# Altium schematic sheet 创意时钟.SchDoc
size A4; PageSetup: Record=PageOptions|CenterHorizontal=True|CenterVertical=True|PrintScale=1.00|XCorrection=1.00|YCorrection=1.00|PrintKind=0|BorderSize=5000000|LeftOffset=0|BottomOffset=0|Orientation=2|PaperLength=2970|PaperWidth=2100|Scale=100|PaperSource=7|PrintQuality=600|MediaType=1|DitherType=10|PrintScaleMode=1|PaperKind=A4|PaperIndex=9
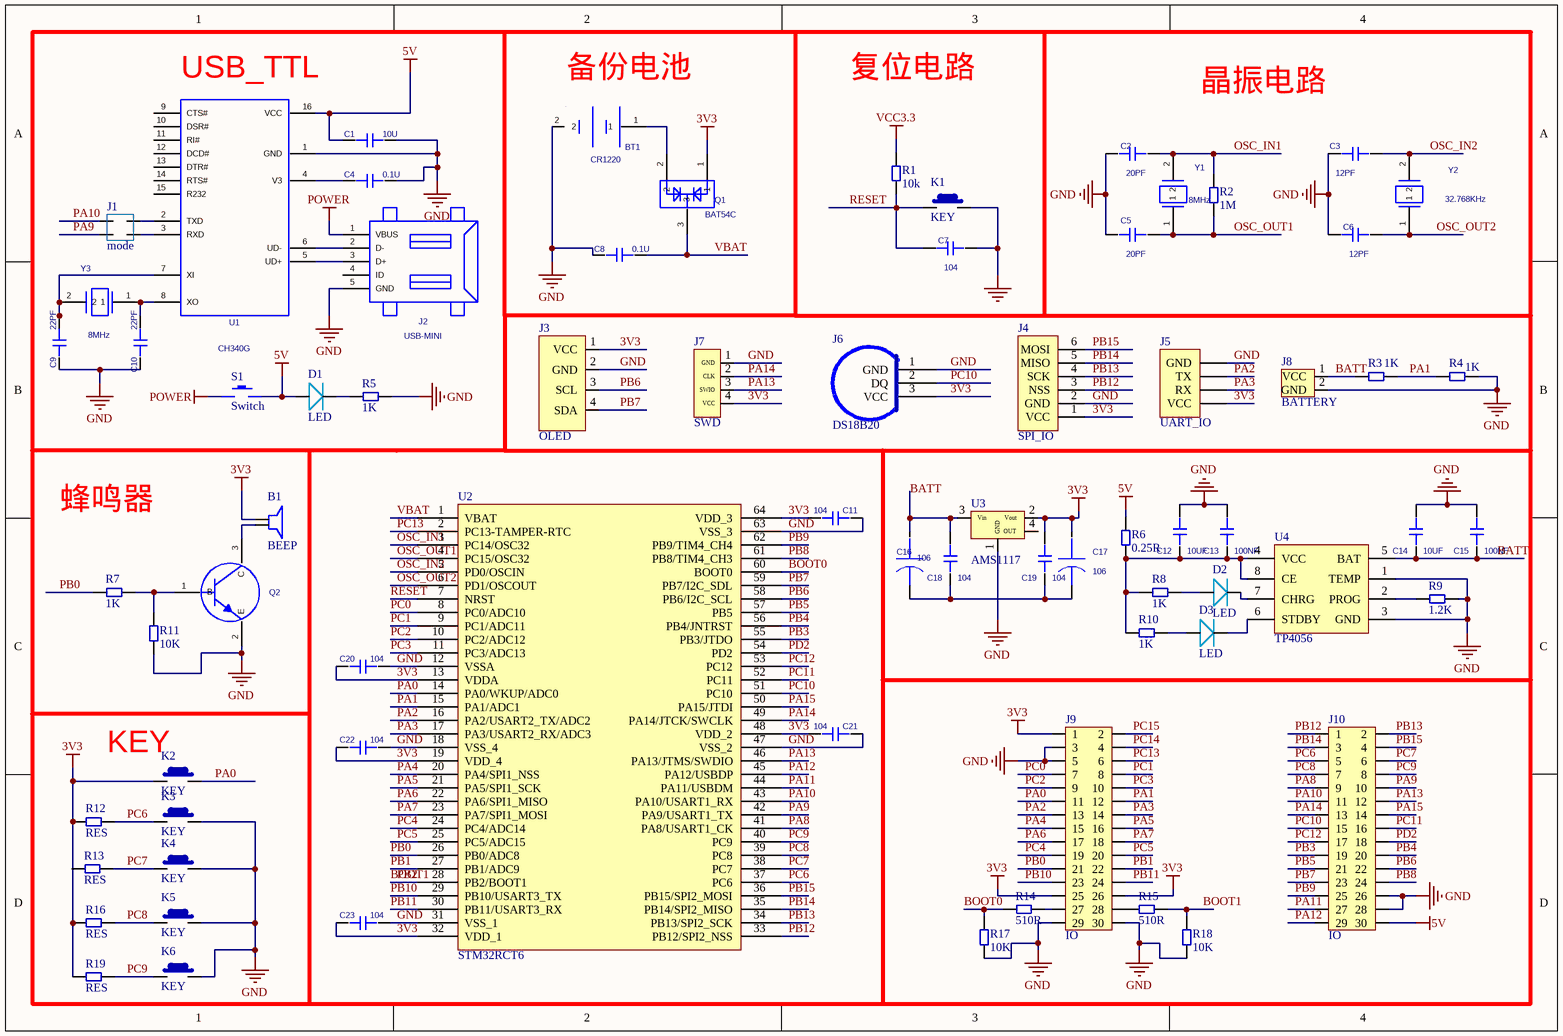
[diagram p0: 创意时钟.SchDoc]

## Parts
B1  BEEP  [BEEP-9.5X5.5]
BT1  CR1220  [BATERY]
C1  value 10U  [RES_0603_FIRE]  (hidden comment: CAP_10P_0603_FIRE)
C2  value 20PF  [CAP_0603_FIRE]  (hidden comment: CAP_20P_0603_FIRE)
C3  value 12PF  [CAP_0603_FIRE]  (hidden comment: CAP_20P_0603_FIRE)
C4  value 0.1U  [RES_0603_FIRE]  (hidden comment: CAP_10P_0603_FIRE)
C5  value 20PF  [CAP_0603_FIRE]  (hidden comment: CAP_20P_0603_FIRE)
C6  value 12PF  [CAP_0603_FIRE]  (hidden comment: CAP_20P_0603_FIRE)
C7  value 104  [CAP_0603_FIRE]  (hidden comment: CAP_20P_0603_FIRE)
C8  value 0.1U  [RES_0603_FIRE]  (hidden comment: CAP_10P_0603_FIRE)
C9  value 22PF  [CAP_0603_FIRE]  (hidden comment: CAP_20P_0603_FIRE)
C10  value 22PF  [CAP_0603_FIRE]  (hidden comment: CAP_20P_0603_FIRE)
C11  value 104  [CAP_0603_FIRE]  (hidden comment: CAP_20P_0603_FIRE)
C12  value 10UF  [RES_0603_FIRE]  (hidden comment: CAP_10P_0603_FIRE)
C13  value 100NF  [RES_0603_FIRE]  (hidden comment: CAP_10P_0603_FIRE)
C14  value 10UF  [RES_0603_FIRE]  (hidden comment: CAP_10P_0603_FIRE)
C15  value 100NF  [RES_0603_FIRE]  (hidden comment: CAP_10P_0603_FIRE)
C16  value 106  [CAP+_47UF_FIRE]  (hidden comment: CAP+_47UF_FIRE)
C17  value 106  [CAP+_47UF_FIRE]  (hidden comment: CAP+_47UF_FIRE)
C18  value 104  [RES_0603_FIRE]  (hidden comment: CAP_10P_0603_FIRE)
C19  value 104  [RES_0603_FIRE]  (hidden comment: CAP_10P_0603_FIRE)
C20  value 104  [CAP_0603_FIRE]  (hidden comment: CAP_20P_0603_FIRE)
C21  value 104  [CAP_0603_FIRE]  (hidden comment: CAP_20P_0603_FIRE)
C22  value 104  [CAP_0603_FIRE]  (hidden comment: CAP_20P_0603_FIRE)
C23  value 104  [CAP_0603_FIRE]  (hidden comment: CAP_20P_0603_FIRE)
D1  LED  [0603_R_JX]
D2  LED  [0603_R_JX]
D3  LED  [0603_R_JX]
J1  mode  [mode]
J2  USB-MINI  [USB_MINI_B_FE_JX]
J3  OLED  [OLED]
J4  SPI_IO  [SPI_IO]
J5  UART_IO  [USART_IO]
J6  DS18B20  [DS18B20]
J7  SWD  [SWD]
J8  BATTERY  [XH_2501R_2P_LOCKED_JX]
J9  IO  [IO]
J10  IO  [IO]
K1  KEY  [KEY]
K2  KEY  [KEY]
K3  KEY  [KEY]
K4  KEY  [KEY]
K5  KEY  [KEY]
K6  KEY  [KEY]
Q1  BAT54C  [SOT-23]
Q2  8050  [SOT-23]  (value not drawn)
R1  10k  [0805]
R2  1M  [0805]
R3  1K  [0805]
R4  1K  [0805]
R5  1K  [0805]
R6  0.25R  [0805]
R7  1K  [0805]
R8  1K  [0805]
R9  1.2K  [0805]
R10  1K  [0805]
R11  10K  [0805]
R12  RES  [0805]
R13  RES  [0805]
R14  510R  [0805]
R15  510R  [0805]
R16  RES  [0805]
R17  10K  [0805]
R18  10K  [0805]
R19  RES  [0805]
S1  Switch  [SWITCH]
U1  CH340G  [SOP16]
U2  STM32RCT6  [LQFP64]
U3  AMS1117  [AMS-1117-3.3]
U4  TP4056  [SOP8_150MIL_JX]
Y1  value 8MHz  [XTAL_socket]  (hidden comment: XTAL_8M_FIRE)
Y2  value 32.768KHz  [CRYS-3X8]  (hidden comment: XTAL_32.768KHZ_FIRE)
Y3  value 8MHz  [XTAL_socket]  (hidden comment: XTAL_8M_FIRE)

## Nets
3V3: B1.1 C11.1 C17.1 C19.2 C20.2 C21.1 C22.2 C23.2 J3.1(VCC) J4.1(VCC) J5.1(VCC) J6.3(VCC) J7.4(VCC) J9.1 J9.25 J9.26 K2.1 Q1.1 R12.1 R16.1 R19.1 U2.13(VDDA) U2.19(VDD_4) U2.32(VDD_1) U2.48(VDD_2) U2.64(VDD_3) U3.2(Vout)
5V: C1.1 D1.1 J10.30 R6.2 S1.2(VCC) U1.16(VCC)
GND: BT1.2 C1.2 C2.1 C3.1 C4.2 C5.1 C6.1 C7.2 C8.1 C9.1 C10.1 C11.2 C12.2 C13.2 C14.2 C15.2 C20.1 C21.2 C22.1 C23.1 J2.5(GND) J3.2(GND) J4.2(GND) J5.4(GND) J6.1(GND) J7.1(GND) J8.2(GND) J9.3 J9.5 J9.29 J9.30 J10.26 J10.28 K1.2 K3.2 K4.2 K5.2 K6.2 Q2.2(E) R4.2 R5.2 R9.2 R11.1 R17.1 R18.1 U1.1(GND) U2.12(VSSA) U2.18(VSS_4) U2.31(VSS_1) U2.47(VSS_2) U2.63(VSS_3) U3.1(GND) U4.1(TEMP) U4.3(GND)
POWER: J2.1(VBUS) S1.1(VCC)
VCC3.3: R1.2
BATT: C14.1 C15.1 C16.1 C18.2 J8.1(VCC) R3.1 U3.3(Vin) U4.5(BAT)
BOOT0: R14.1 R17.2 U2.60(BOOT0)
BOOT1: R15.2 R18.2 U2.28(PB2/BOOT1)  [also labelled PB2]
OSC_IN1: C2.2 R2.2 U2.3(PC14/OSC32) Y1.2
OSC_IN2: C3.2 U2.5(PD0/OSCIN) Y2.2
OSC_OUT1: C5.2 R2.1 U2.4(PC15/OSC32) Y1.1
OSC_OUT2: C6.2 U2.6(PD1/OSCOUT) Y2.1
PA0: J9.11 K2.2 U2.14(PA0/WKUP/ADC0)
PA1: J9.12 R3.2 R4.1 U2.15(PA1/ADC1)
PA2: J5.3(TX) J9.13 U2.16(PA2/USART2_TX/ADC2)
PA3: J5.2(RX) J9.14 U2.17(PA3/USART2_RX/ADC3)
PA4: J9.15 U2.20(PA4/SPI1_NSS)
PA5: J9.16 U2.21(PA5/SPI1_SCK)
PA6: J9.17 U2.22(PA6/SPI1_MISO)
PA7: J9.18 U2.23(PA7/SPI1_MOSI)
PA8: J10.9 U2.41(PA8/USART1_CK)
PA9: J1.2 J10.10 U2.42(PA9/USART1_TX)
PA10: J1.1 J10.11 U2.43(PA10/USART1_RX)
PA11: J10.27 U2.44(PA11/USBDM)
PA12: J10.29 U2.45(PA12/USBDP)
PA13: J7.3(SWIO) J10.12 U2.46(PA13/JTMS/SWDIO)
PA14: J7.2(CLK) J10.13 U2.49(PA14/JTCK/SWCLK)
PA15: J10.14 U2.50(PA15/JTDI)
PB0: J9.21 R7.1 U2.26(PB0/ADC8)
PB1: J9.22 U2.27(PB1/ADC9)
PB3: J10.19 U2.55(PB3/JTDO)
PB4: J10.20 U2.56(PB4/JNTRST)
PB5: J10.21 U2.57(PB5)
PB6: J3.3(SCL) J10.22 U2.58(PB6/I2C_SCL)
PB7: J3.4(SDA) J10.23 U2.59(PB7/I2C_SDL)
PB8: J10.24 U2.61(PB8/TIM4_CH3)
PB9: J10.25 U2.62(PB9/TIM4_CH4)
PB10: J9.23 U2.29(PB10/USART3_TX)
PB11: J9.24 U2.30(PB11/USART3_RX)
PB12: J4.3(NSS) J10.1 U2.33(PB12/SPI2_NSS)
PB13: J4.4(SCK) J10.2 U2.34(PB13/SPI2_SCK)
PB14: J4.5(MISO) J10.3 U2.35(PB14/SPI2_MISO)
PB15: J4.6(MOSI) J10.4 U2.36(PB15/SPI2_MOSI)
PC0: J9.7 U2.8(PC0/ADC10)
PC1: J9.8 U2.9(PC1/ADC11)
PC2: J9.9 U2.10(PC2/ADC12)
PC3: J9.10 U2.11(PC3/ADC13)
PC4: J9.19 U2.24(PC4/ADC14)
PC5: J9.20 U2.25(PC5/ADC15)
PC6: J10.5 K3.1 R12.2 U2.37(PC6)
PC7: J10.6 K4.1 R13.2 U2.38(PC7)
PC8: J10.7 K5.1 R16.2 U2.39(PC8)
PC9: J10.8 K6.1 R19.2 U2.40(PC9)
PC10: J6.2(DQ) J10.15 U2.51(PC10)
PC11: J10.16 U2.52(PC11)
PC12: J10.17 U2.53(PC12)
PC13: J9.6 U2.2(PC13-TAMPER-RTC)
PC14: J9.4
PC15: J9.2
PD2: J10.18 U2.54(PD2)
RESET: C7.1 K1.1 R1.1 U2.7(NRST)
VBAT: C8.2 Q1.3 U2.1(VBAT)
NetB1_2: B1.2 Q2.3(C)
NetBT1_1: BT1.1 Q1.2
NetC4_1: C4.1 U1.4(V3)
NetC9_2: C9.2 U1.7(XI) Y3.2
NetC10_2: C10.2 U1.8(XO) Y3.1
NetC12_1: C12.1 C13.1 R6.1 R8.1 R10.1 U4.4(VCC) U4.8(CE)
NetC16_2: C16.2 C17.2 C18.1 C19.1
NetD1_2: D1.2 R5.1
NetD2_1: D2.1 R8.2
NetD2_2: D2.2 U4.7(CHRG)
NetD3_1: D3.1 R10.2
NetD3_2: D3.2 U4.6(STDBY)
NetJ1_3: J1.3 U1.2(TXD)
NetJ1_4: J1.4 U1.3(RXD)
NetJ2_2: J2.2(D-) U1.6(UD-)
NetJ2_3: J2.3(D+) U1.5(UD+)
NetJ9_27: J9.27 R14.2
NetJ9_28: J9.28 R15.1
NetQ2_1: Q2.1(B) R7.2 R11.2
NetR9_1: R9.1 U4.2(PROG)

Not connected (* = marked no-connect by the designer): J2 4(ID); R13 1; U1 9(CTS#) 10(DSR#) 11(RI#) 12(DCD#) 13(DTR#) 14(RTS#) 15(R232); U3 4(OUT)

## Notes on the sheet
- (near U1) USB_TTL
- (near BT1) 备份电池
- 复位电路
- 晶振电路
- 蜂鸣器
- (near K2) KEY

## Library data of the parts
C1 C4 C8 C12-C15 C18 C19 = CAP_10P_0603_FIRE: 0603; Manufacture 1: SUPERCAP; Tolerance: +-5%; PCB DECAL: RES_0603_FIRE
J8 = BATTER
Q2 = 8050: NPN; Manufacturer #2: 8050; PCB DECAL: SOT-23
R1-R11 R14 R15 R17 R18 = RES
Y1 Y3 = XTAL_8M_FIRE: CRYSTAL; PCB DECAL: CRYSTAL_SMD_FIRE
Y2 = XTAL_32.768KHZ_FIRE: CRYSTAL; PCB DECAL: CRYS-3X8
BT1 = CR1220: PCB DECAL: BATERY
C2 C3 C5-C7 C9-C11 C20-C23 = CAP_20P_0603_FIRE: PCB DECAL: CAP_0603_FIRE
C16 C17 = CAP+_47UF_FIRE: PCB DECAL: CAP+_47UF_FIRE
J2 = USB-MINI: PCB DECAL: USB-MINI
Q1 = BAT54C: Value: BAT54C; PCB DECAL: SOT-23
U1 = CH340G: PCB DECAL: SOP16